# Altium schematic sheet Sheet7.SchDoc
size A4
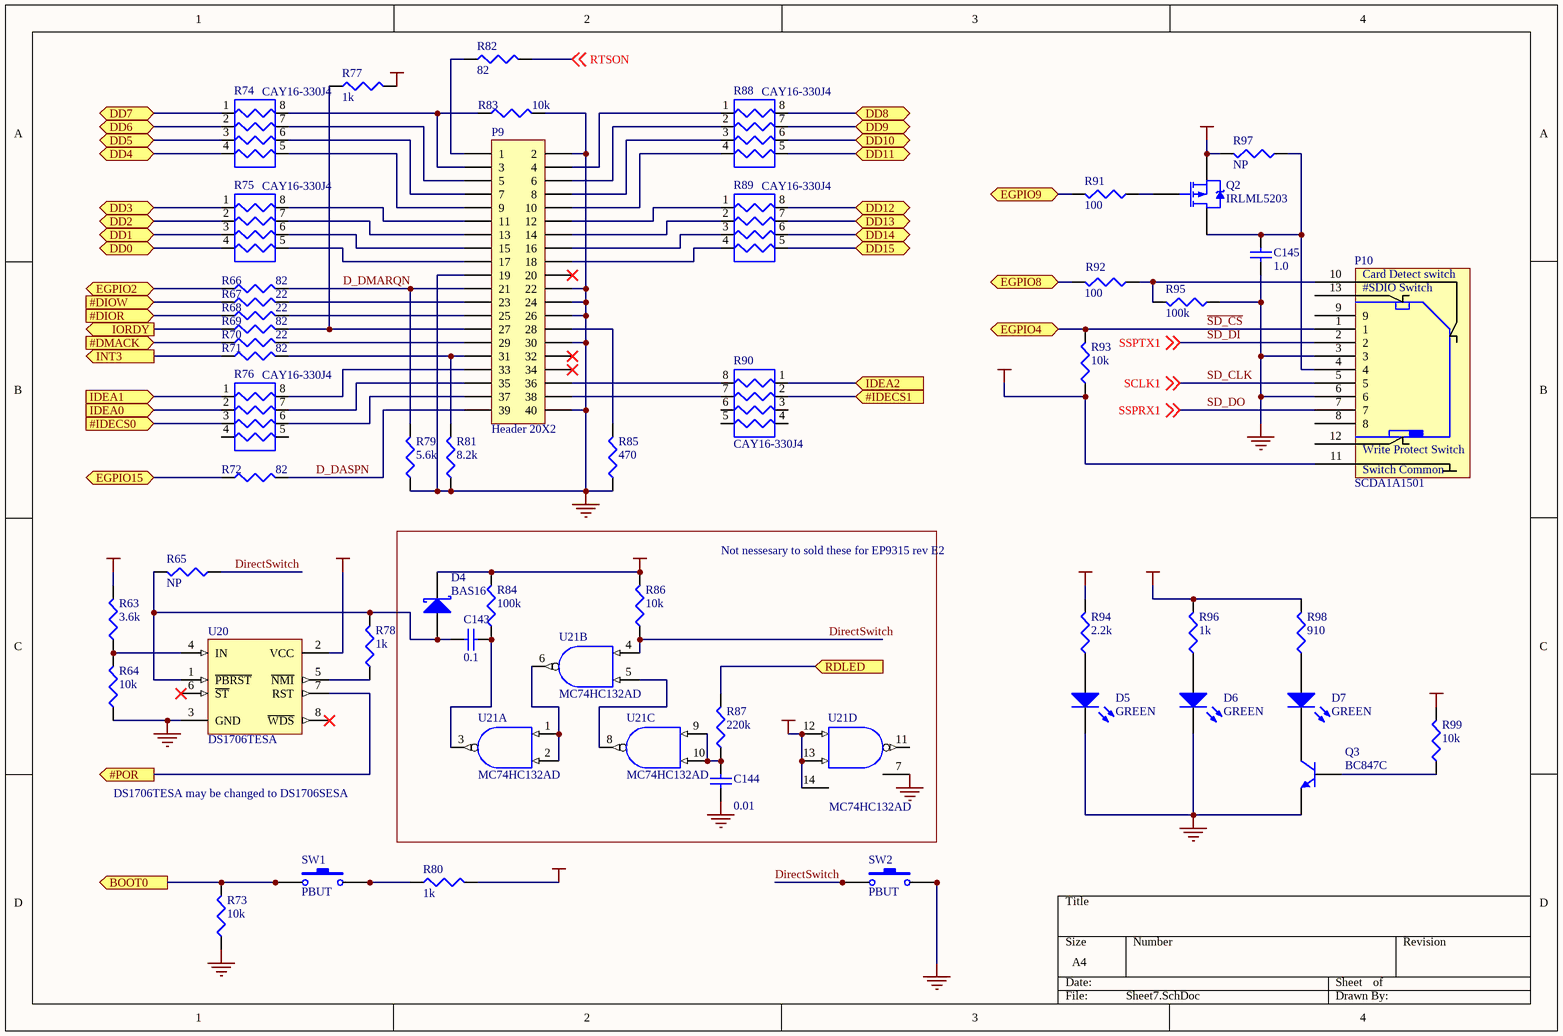
[diagram p0: Sheet7.SchDoc]

## Parts
C143  0.1  [0603]
C144  0.01  [0603]
C145  1.0  [0603]
D4  BAS16  [SOT23]
D5  GREEN  [DSO-F2/D6.1]
D6  GREEN  [DSO-F2/D6.1]
D7  GREEN  [DSO-F2/D6.1]
P9  Header 20X2  [HDR2X20]
P10  SCDA1A1501  [SCDA_NO2]
Q2  IRLML5203  [SOT-23]
Q3  BC847C  [SOT23]
R63  3.6k  [CR1608-0603]
R64  10k  [CR1608-0603]
R65  NP  [CR1608-0603]
R66  82  [CR1608-0603]
R67  22  [CR1608-0603]
R68  22  [CR1608-0603]
R69  82  [CR1608-0603]
R70  22  [CR1608-0603]
R71  82  [CR1608-0603]
R72  82  [CR1608-0603]
R73  10k  [CR1608-0603]
R74  CAY16-330J4  [CAY16-J4]
R75  CAY16-330J4  [CAY16-J4]
R76  CAY16-330J4  [CAY16-J4]
R77  1k  [CR1608-0603]
R78  1k  [CR1608-0603]
R79  5.6k  [CR1608-0603]
R80  1k  [CR1608-0603]
R81  8.2k  [CR1608-0603]
R82  82  [CR1608-0603]
R83  10k  [CR1608-0603]
R84  100k  [CR1608-0603]
R85  470  [CR1608-0603]
R86  10k  [CR1608-0603]
R87  220k  [CR1608-0603]
R88  CAY16-330J4  [CAY16-J4]
R89  CAY16-330J4  [CAY16-J4]
R90  CAY16-330J4  [CAY16-J4]
R91  100  [CR1608-0603]
R92  100  [CR1608-0603]
R93  10k  [CR1608-0603]
R94  2.2k  [CR1608-0603]
R95  100k  [CR1608-0603]
R96  1k  [CR1608-0603]
R97  NP  [CR1608-0603]
R98  910  [CR1608-0603]
R99  10k  [CR1608-0603]
SW1  PBUT  [SWBUTDIP4]
SW2  PBUT  [SWBUTDIP4]
U20  DS1706TESA  [SOIC8N]
U21  MC74HC132AD  [751A-03]  (parts A,B,C,D of 4)

## Blocks framed on the sheet
Not nessesary to sold these for EP9315 rev E2: C143 C144 D4 R84 R86 R87 U21

## Ports
#DIOR (in), #DIOW (in), #DMACK (in), #IDECS0 (in), #IDECS1 (in), #POR (out), BOOT0 (out), DD0 (bidir), DD1 (bidir), DD2 (bidir), DD3 (bidir), DD4 (bidir), DD5 (bidir), DD6 (bidir), DD7 (bidir), DD8 (bidir), DD9 (bidir), DD10 (bidir), DD11 (bidir), DD12 (bidir), DD13 (bidir), DD14 (bidir), DD15 (bidir), EGPIO2 (bidir), EGPIO4 (bidir), EGPIO8 (bidir), EGPIO9 (bidir), EGPIO15 (bidir), IDEA0 (in), IDEA1 (in), IDEA2 (in), INT3 (out), IORDY (out), RDLED (in)

## Nets
GND: C144.1 C145.1 D5.2(K) D6.2(K) P9.2 P9.19 P9.22 P9.24 P9.26 P9.30 P9.40 P10.3 P10.6 Q3.2(E) R64.1 R73.1 R79.1 R81.1 R83.2 R85.1 R95.1 SW2.2 SW2.3 U20.3(GND) U21.7(GND)
VCC5V0: R94.2
VCCCORE: R63.2 R99.2
VCCIO: D4.3(K) P10.11(common) Q2.2(S) R77.2 R80.2 R84.2 R86.2 R93.1 R96.2 R97.2 R98.2 U20.2(VCC) U21.12(A) U21.13(B) U21.14(VDD)  [also labelled VDD]
#DIOR: R68.1 ; port #DIOR
#DIOW: R67.1 ; port #DIOW
#DMACK: R70.1 ; port #DMACK
#IDECS0: R76.3 ; port #IDECS0
#IDECS1: R90.2 ; port #IDECS1
#POR: U20.7(RST) ; port #POR
BOOT0: R73.2 SW1.1 SW1.4 ; port BOOT0
D_DASPN: P9.39 R72.2
D_DMARQN: P9.21 R66.2 R79.2
DD0: R75.4 ; port DD0
DD1: R75.3 ; port DD1
DD2: R75.2 ; port DD2
DD3: R75.1 ; port DD3
DD4: R74.4 ; port DD4
DD5: R74.3 ; port DD5
DD6: R74.2 ; port DD6
DD7: R74.1 ; port DD7
DD8: R88.8 ; port DD8
DD9: R88.7 ; port DD9
DD10: R88.6 ; port DD10
DD11: R88.5 ; port DD11
DD12: R89.8 ; port DD12
DD13: R89.7 ; port DD13
DD14: R89.6 ; port DD14
DD15: R89.5 ; port DD15
DirectSwitch: R65.1 R86.1 SW2.1 SW2.4 U21.4(A)
EGPIO2: R66.1 ; port EGPIO2
EGPIO8: R92.2 ; port EGPIO8
EGPIO9: R91.2 ; port EGPIO9
EGPIO15: R72.1 ; port EGPIO15
IDEA0: R76.2 ; port IDEA0
IDEA1: R76.1 ; port IDEA1
IDEA2: R90.1 ; port IDEA2
INT3: R71.1 ; port INT3
IORDY: R69.1 ; port IORDY
RDLED: R87.2 ; port RDLED
RTSON: R82.2 ; off-sheet RTSON
~{SD_CS}: P10.1 R93.2 ; port EGPIO4
SD_CLK: P10.5 ; off-sheet SCLK1  [also labelled SCLK1]
SD_DI: P10.2 ; off-sheet SSPTX1  [also labelled SSPTX1]
SD_DO: P10.7 ; off-sheet SSPRX1  [also labelled SSPRX1]
NetC143_1: C143.1 R84.1 U21.3(Y)
NetC143_2: C143.2 D4.1(A) R65.2 R78.2 U20.1(~{PBRST})
NetC144_2: C144.2 R87.1 U21.9(A) U21.10(B)
NetC145_2: C145.2 P10.4 Q2.3(D) R97.1
NetD5_1: D5.1(A) R94.1
NetD6_1: D6.1(A) R96.1
NetD7_1: D7.1(A) R98.1
NetD7_2: D7.2(K) Q3.3(C)
NetP9_1: P9.1 R82.1
NetP9_3: P9.3 R74.8 R83.1
NetP9_4: P9.4 R88.1
NetP9_5: P9.5 R74.7
NetP9_6: P9.6 R88.2
NetP9_7: P9.7 R74.6
NetP9_8: P9.8 R88.3
NetP9_9: P9.9 R74.5
NetP9_10: P9.10 R88.4
NetP9_11: P9.11 R75.8
NetP9_12: P9.12 R89.1
NetP9_13: P9.13 R75.7
NetP9_14: P9.14 R89.2
NetP9_15: P9.15 R75.6
NetP9_16: P9.16 R89.3
NetP9_17: P9.17 R75.5
NetP9_18: P9.18 R89.4
NetP9_23: P9.23 R67.2
NetP9_25: P9.25 R68.2
NetP9_27: P9.27 R69.2 R77.1
NetP9_28: P9.28 R85.2
NetP9_29: P9.29 R70.2
NetP9_31: P9.31 R71.2 R81.2
NetP9_33: P9.33 R76.8
NetP9_35: P9.35 R76.7
NetP9_36: P9.36 R90.8
NetP9_37: P9.37 R76.6
NetP9_38: P9.38 R90.7
NetP10_10: P10.10(CDETECT) R92.1 R95.2
NetQ2_1: Q2.1(G) R91.1
NetQ3_1: Q3.1(B) R99.1
NetR63_1: R63.1 R64.2 U20.4(IN)
NetR78_1: R78.1 U20.5(~{NMI})
NetR80_1: R80.1 SW1.2 SW1.3
NetU21_1: U21.1(A) U21.2(B) U21.6(Y)
NetU21_5: U21.5(B) U21.8(Y)

Not connected (* = marked no-connect by the designer): P9 20* 32* 34*; P10 8 9 12(WP) 13(SDIO); R76 4 5; R90 3 4 5 6; U20 6(~{ST})* 8(~{WDS})*; U21 11(Y)

## Notes on the sheet
- DS1706TESA may be changed to DS1706SESA
- (in symbol SCDA1A1501) Card Detect switch; #SDIO Switch; Write Protect Switch; Switch Common

## Library data of the parts
C143-C145 = C0603: Ceramic Chip Capacitor - Standard; Note: Footprint corresponds to dimensions for bulk cassette packaging. This case size has tightened tolerances.; Published: 17-Jul-2002; LatestRevisionDate: 19-Mar-2004; LatestRevisionNote: Silkscreen size reduced.; DatasheetDocument: Mar-2001; PackageDocument: Mar-2001; PackageReference: 0603; Publisher: Altium Limited; Code_JEITA: 0603; Code_IPC: 1608 [0603]; ComponentLink1Description: Manufacturer Link; ComponentLink1URL: http://www.kemet.com/; ComponentLink2Description: Datasheet; ComponentLink2URL: http://www.kemet.com/kemet/web/homepage/kechome.nsf/vapubfilesname/F3102TA.pdf/$file/F3102TA.pdf
  C143: Value: 0.1
  C144: Value: 0.01
  C145: Value: 1.0
D4 = BAS40: Schottky Barrier Diode; Note: Pin 2 is not connected and is not drawn; Published: 17-Sep-2003; DatasheetDocument: 10-Feb-2001; PackageDocument: May-1999; PackageReference: SOT23; Publisher: Altium Limited; ComponentLink1Description: Manufacturer Link; ComponentLink1URL: http://www.semiconductors.philips.com/; ComponentLink2Description: Datasheet; ComponentLink2URL: http://www.semiconductors.philips.com/acrobat/datasheets/BAS40_SERIES_5.pdf
D5-D7 = LED2: Typical RED, GREEN, YELLOW, AMBER GaAs LED; Published: 8-Jun-2000; Revision: July-2002: Re-released for DXP Platform.; Publisher: Altium Limited
P9 = Header 20X2: Header, 20-Pin, Dual row; LatestRevisionDate: 17-Jul-2002; LatestRevisionNote: Re-released for DXP Platform.; Publisher: Altium Limited
P10 = SCDA1A1501: Connector for SD Memory Card
Q2 = IRLML5103: HEXFET Power MOSFET; Published: 8-Jun-2000; LatestRevisionDate: 17-Jul-2002; LatestRevisionNote: Re-released for DXP Platform.; DatasheetDocument: Aug-1997; PackageReference: SOT-23; Publisher: Altium Limited; ComponentLink1Description: Manufacturer Link; ComponentLink1URL: http://www.irf.com/
Q3 = BC847C: NPN General-purpose Transistor; Published: 17-Sep-2003; DatasheetDocument: 4-Feb-2002; PackageDocument: May-1999; PackageReference: SOT23; Publisher: Altium Limited; ComponentLink1Description: Manufacturer Link; ComponentLink1URL: http://www.semiconductors.philips.com/; ComponentLink2Description: Datasheet; ComponentLink2URL: http://www.semiconductors.philips.com/acrobat/datasheets/BC846_BC847_BC848_5.pdf
R63-R73 R77-R87 R91-R99 = Res3: Resistor; Published: 8-Jun-2000; Revision: July-2002: Re-released for DXP Platform.; Publisher: Altium Limited
  R63: Value: 3.6k
  R64 R73 R83 R86 R93 R99: Value: 10k
  R65 R97: Value: NP
  R66 R69 R71 R72 R82: Value: 82
  R67 R68 R70: Value: 22
  R77 R78 R80 R96: Value: 1k
  R79: Value: 5.6k
  R81: Value: 8.2k
  R84 R95: Value: 100k
  R85: Value: 470
  R87: Value: 220k
  R91 R92: Value: 100
  R94: Value: 2.2k
  R98: Value: 910
R74-R76 R88-R90 = CAY16-J4: Chip Resistor Arrays
SW1 SW2 = PBUT: DIP4 PushButton
U20 = DS1706LESA: 3.3 and 5.0 Volt MicroMonitor; PackageDocument: 1999; Published: 13-Oct-2000; LatestRevisionDate: 4-Mar-2005; LatestRevisionNote: Stylized 3D Model Added.; DatasheetDocument: 4-Sep-1998; PackageReference: SOIC8N; Publisher: Altium Limited; ComponentLink1Description: Manufacturer Link; ComponentLink1URL: http://www.maxim-ic.com/
U21 = MC74HC132AD: Quad 2-Input NAND Gate with Schmitt Trigger Inputs; Published: 15-Apr-2002; DatasheetDocument: Mar-2000; PackageReference: 751A-03; Publisher: Altium Limited; Code_JEDEC: MS-012-AB; Code_IPC: SO14; ComponentLink1Description: Manufacturer Link; ComponentLink1URL: http://www.onsemi.com/